# Altium schematic sheet ESP.SchDoc
size A4; SheetNumber: 3; SheetTotal: 8
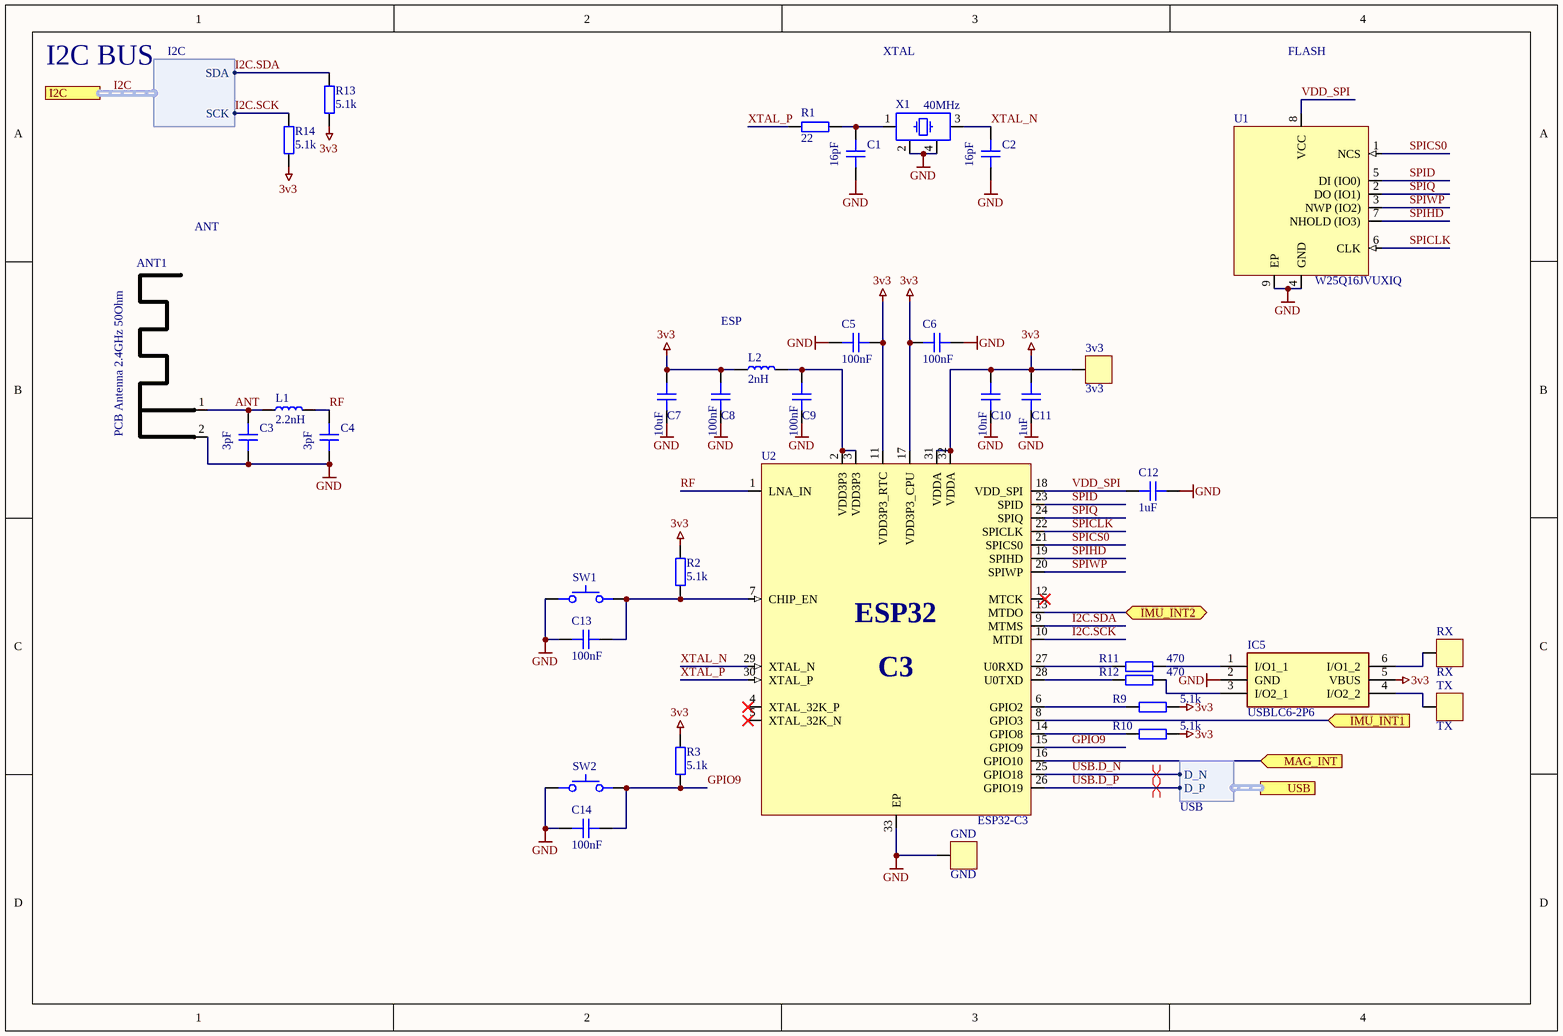
[diagram p0: ESP.SchDoc]

## Parts
3v3  3v3  [PAD_SQ_2MM]  (no BOM)
ANT1  PCB Antenna 2.4GHz 50Ohm  [ANT_IFA_USB_2_4GHZ_50R]  (no BOM)
C1  value 16pF  [CAP_0402]  (hidden comment: C0402_10V)
C2  value 16pF  [CAP_0402]  (hidden comment: C0402_10V)
C3  value 3pF  [CAP_0402]  (hidden comment: C0402_10V)
C4  value 3pF  [CAP_0402]  (hidden comment: C0402_10V)
C5  value 100nF  [CAP_0402]  (hidden comment: C0402_10V)
C6  value 100nF  [CAP_0402]  (hidden comment: C0402_10V)
C7  value 10uF  [CAP_0402]  (hidden comment: C0402_10V)
C8  value 100nF  [CAP_0402]  (hidden comment: C0402_10V)
C9  value 100nF  [CAP_0402]  (hidden comment: C0402_10V)
C10  value 10nF  [CAP_0402]  (hidden comment: C0402_10V)
C11  value 1uF  [CAP_0402]  (hidden comment: C0402_10V)
C12  value 1uF  [CAP_0402]  (hidden comment: C0402_10V)
C13  value 100nF  [CAP_0402]  (hidden comment: C0402_10V)
C14  value 100nF  [CAP_0402]  (hidden comment: C0402_10V)
GND  GND  [PAD_SQ_2MM]  (no BOM)
IC5  USBLC6-2P6  [USBLC62P6]
L1  value 2.2nH  [IND_0402]  (hidden comment: L0402)
L2  value 2nH  [IND_0402]  (hidden comment: L0402)
R1  value 22  [RES_0402]  (hidden comment: R0402)
R2  value 5.1k  [RES_0402]  (hidden comment: R0402)
R3  value 5.1k  [RES_0402]  (hidden comment: R0402)
R9  value 5.1k  [RES_0402]  (hidden comment: R0402)
R10  value 5.1k  [RES_0402]  (hidden comment: R0402)
R11  value 470  [RES_0402]  (hidden comment: R0402)
R12  value 470  [RES_0402]  (hidden comment: R0402)
R13  value 5.1k  [RES_0402]  (hidden comment: R0402)
R14  value 5.1k  [RES_0402]  (hidden comment: R0402)
RX  RX  [PAD_SQ_2MM]  (no BOM)
SW1  SKRPANE010  [SKRPANE010]  (value not drawn)
SW2  SKRPANE010  [SKRPANE010]  (value not drawn)
TX  TX  [PAD_SQ_2MM]  (no BOM)
U1  W25Q16JVUXIQ  [USON-8-2X3MM]
U2  ESP32-C3  [QFN32-5x5]
X1  40MHz  [XTAL_2520]

## Ports
I2C (harness I2C, see Top Level Organization[3A], IMU[1A], MAG[1A]), IMU_INT1 (in, see Top Level Organization[3B], IMU[3B]), IMU_INT2 (bidir, see Top Level Organization[3B], IMU[3B]), MAG_INT (in, see Top Level Organization[3C], MAG[2B]), USB (harness USB, see Top Level Organization[3C], CONNECTORS[3B])

## Harnesses
I2C: SDA, SCK
USB: D_P, D_N

## Nets
3v3: 3v3.1 C5.1 C6.2 C7.2 C8.2 C10.2 C11.1 IC5.5(VBUS) L2.1 R2.2 R3.2 R9.1 R10.1 R13.2 R14.2 U2.11(VDD3P3_RTC) U2.17(VDD3P3_CPU) U2.31(VDDA) U2.32(VDDA)
GND: ANT1.2(GND) C1.1 C2.1 C3.1 C4.1 C5.2 C6.1 C7.1 C8.1 C9.1 C10.1 C11.2 C12.1 C13.2 C14.2 GND.1 IC5.2(GND) SW1.12 SW2.12 U1.4(GND) U1.9(EP) U2.33(EP) X1.2 X1.4
ANT: ANT1.1(RF) C3.2 L1.1
GPIO9: C14.1 R3.1 SW2.34 U2.15(GPIO9)
I2C.SCK: R14.1 U2.10(MTDI) ; port I2C.SCK
I2C.SDA: R13.1 U2.9(MTMS) ; port I2C.SDA
IMU_INT1: U2.8(GPIO3) ; port IMU_INT1
IMU_INT2: U2.13(MTDO) ; port IMU_INT2
MAG_INT: U2.16(GPIO10) ; port MAG_INT
RF: C4.2 L1.2 U2.1(LNA_IN)
SPICLK: U1.6(CLK) U2.22(SPICLK)
SPICS0: U1.1(NCS) U2.21(SPICS0)
SPID: U1.5(DI_(IO0)) U2.23(SPID)
SPIHD: U1.7(NHOLD_(IO3)) U2.19(SPIHD)
SPIQ: U1.2(DO_(IO1)) U2.24(SPIQ)
SPIWP: U1.3(NWP_(IO2)) U2.20(SPIWP)
USB.D_N: U2.25(GPIO18) ; port USB.D_N
USB.D_P: U2.26(GPIO19) ; port USB.D_P
VDD_SPI: C12.2 U1.8(VCC) U2.18(VDD_SPI)
XTAL_N: C2.2 U2.29(XTAL_N) X1.3
XTAL_P: R1.1 U2.30(XTAL_P)
NetC1_2: C1.2 R1.2 X1.1
NetC9_2: C9.2 L2.2 U2.2(VDD3P3) U2.3(VDD3P3)
NetC13_1: C13.1 R2.1 SW1.34 U2.7(CHIP_EN)
NetIC5_1: IC5.1(I/O1_1) R11.1
NetIC5_3: IC5.3(I/O2_1) R12.1
NetIC5_4: IC5.4(I/O2_2) TX.1
NetIC5_6: IC5.6(I/O1_2) RX.1
NetR9_2: R9.2 U2.6(GPIO2)
NetR10_2: R10.2 U2.14(GPIO8)
NetR11_2: R11.2 U2.27(U0RXD)
NetR12_2: R12.2 U2.28(U0TXD)

Not connected (* = marked no-connect by the designer): U2 4(XTAL_32K_P)* 5(XTAL_32K_N)* 12(MTCK)*

## Buses and harness runs
harness I2C = port I2C

## Layout directives
differential pair; differential pair class DIFF_USB: USB.D_N, USB.D_P

## Notes on the sheet
- I2C BUS
- XTAL
- FLASH
- ANT
- ESP
- (in symbol ESP32-C3) ESP32; C3

## Library data of the parts
3v3 GND RX TX = PAD_SQ_2MM: Test Point Square 2mm
ANT1 = ANT_IFA_USB_2_4GHZ_50R: Inverted F 2.4GHz ISM PCB Antenna 50 Ohm; ComponentLink1Description: Datasheet; ComponentLink1URL: https://www.ti.com/lit/an/swra117d/swra117d.pdf
C1-C14 = CAP_0402_10V: Capacitor SMD 0402 10V
IC5 = USBLC6-2P6: Integrated Circuit; Manufacturer_Name: STMicroelectronics; Datasheet Link: https://datasheet.lcsc.com/szlcsc/STMicroelectronics-USBLC6-2P6_C15999.pdf; Height: 0.6mm; Manufacturer_Part_Number: USBLC6-2P6; Mouser Part Number: 511-USBLC6-2P6; Mouser Price/Stock: https://www.mouser.co.uk/ProductDetail/STMicroelectronics/USBLC6-2P6?qs=6ARB0lp6jlViGcbUSvj1Mw%3D%3D; Arrow Part Number: USBLC6-2P6; Arrow Price/Stock: https://www.arrow.com/en/products/usblc6-2p6/stmicroelectronics?region=nac
L1 L2 = IND_0402: Inductor SMD 0402
R1-R3 R9-R14 = RES_0402: Resistor SMD 0402; Manufacturer: *; Manufacturer Part Number: *; Distributor Link: *
SW1 SW2 = SKRPANE010: Tactile Switch SMD SPST; Manufacturer: Alps Alpine; Manufacturer Part Number: SKRPANE010
U1 = W25Q16JVUXIQ: 16M-BIT SERIAL FLASH MEMORY WITH DUAL/QUAD SPI USON-8; Manufacturer: Winbond; Manufacturer Part Number: W25Q16JVUXIQ; LCSC: C2843335
U2 = ESP32-C3: Ultra­Low­Power SoC with RISC­V Single­Core CPU Supporting IEEE 802.11b/g/n (2.4 GHz Wi­Fi) and Bluetooth® 5 (LE); Manufacturer: Espressif; Manufacturer Part Number: ESP32-C3; LCSC: C2838500
X1 = XTAL_2520: Crystal SMD 2520; Distributor Link: *